# Altium schematic sheet POWER.SchDoc
size A
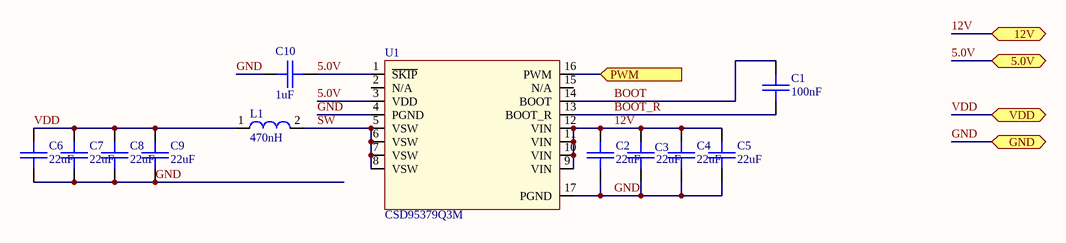
[diagram p0: POWER.SchDoc]

## Parts
C1  100nF  [SMD_0603_CAPC1608X95N]
C2  22uF  [SMD_0805_CAPC2012X95N]
C3  22uF  [SMD_0805_CAPC2012X95N]
C4  22uF  [SMD_0805_CAPC2012X95N]
C5  22uF  [SMD_0805_CAPC2012X95N]
C6  22uF  [SMD_0805_CAPC2012X95N]
C7  22uF  [SMD_0805_CAPC2012X95N]
C8  22uF  [SMD_0805_CAPC2012X95N]
C9  22uF  [SMD_0805_CAPC2012X95N]
C10  1uF  [SMD_0603_CAPC1608X95N]
L1  470nH  [SMD_INDM720X665X300]
U1  CSD95379Q3M  [SMD_SON50P340X340X80-21N - VSON10]

## Ports
5.0V, 12V, GND, PWM (in), VDD

## Nets
5.0V: C10.1 U1.1(~{SKIP}) U1.3(VDD) ; port 5.0V
12V: C2.1 C3.1 C4.1 C5.1 U1.9(VIN) U1.10(VIN) U1.11(VIN) U1.12(VIN) ; port 12V
BOOT: C1.1 U1.14(BOOT)
BOOT_R: C1.2 U1.13(BOOT_R)
GND: C2.2 C3.2 C4.2 C5.2 C6.2 C7.2 C8.2 C9.2 C10.2 U1.4(PGND) U1.17(PGND) ; port GND
PWM: U1.16(PWM) ; port PWM
SW: L1.2 U1.5(VSW) U1.6(VSW) U1.7(VSW) U1.8(VSW)
VDD: C6.1 C7.1 C8.1 C9.1 L1.1 ; port VDD

Not connected (* = marked no-connect by the designer): U1 2(N/A) 15(N/A)

## Library data of the parts
C1-C10 = C: NOTE: <NOTE>
L1 = L
U1 = IC_CSD95379Q3M: Texas Instrumendts Buck Boost DC-DC